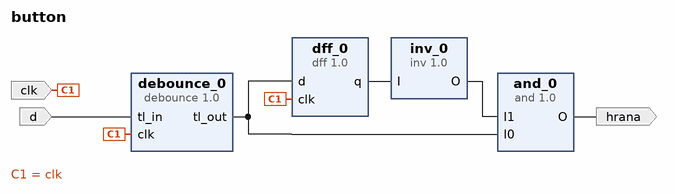
[diagram p0: block diagram of the top level]
# Vivado block design button, xc7a35tcpg236-1, Vivado 2018.3
create_bd_design button

create_bd_port -dir O -type data hrana
create_bd_port -dir I clk
create_bd_port -dir I d

create_bd_cell -type ip -vlnv FIT:user:dff:1.0 dff_0
set_property -dict {CONFIG.Reset false} [get_bd_cells dff_0]
create_bd_cell -type ip -vlnv FIT:user:inv:1.0 inv_0
create_bd_cell -type ip -vlnv FIT:user:and:1.0 and_0
create_bd_cell -type ip -vlnv FIT:user:debounce:1.0 debounce_0

# ---- connections ----

connect_bd_net [get_bd_pins inv_0/O] [get_bd_pins and_0/I1]
connect_bd_net [get_bd_ports clk] [get_bd_pins dff_0/clk] [get_bd_pins debounce_0/clk]
connect_bd_net [get_bd_pins and_0/O] [get_bd_ports hrana]
connect_bd_net [get_bd_pins dff_0/q] [get_bd_pins inv_0/I]
connect_bd_net [get_bd_ports d] [get_bd_pins debounce_0/tl_in]
connect_bd_net [get_bd_pins debounce_0/tl_out] [get_bd_pins dff_0/d] [get_bd_pins and_0/I0]

validate_bd_design
save_bd_design
